# Altium schematic sheet WARNING_LEDS.SchDoc
size A; DocumentNumber: 8; SheetNumber: 8; SheetTotal: 12
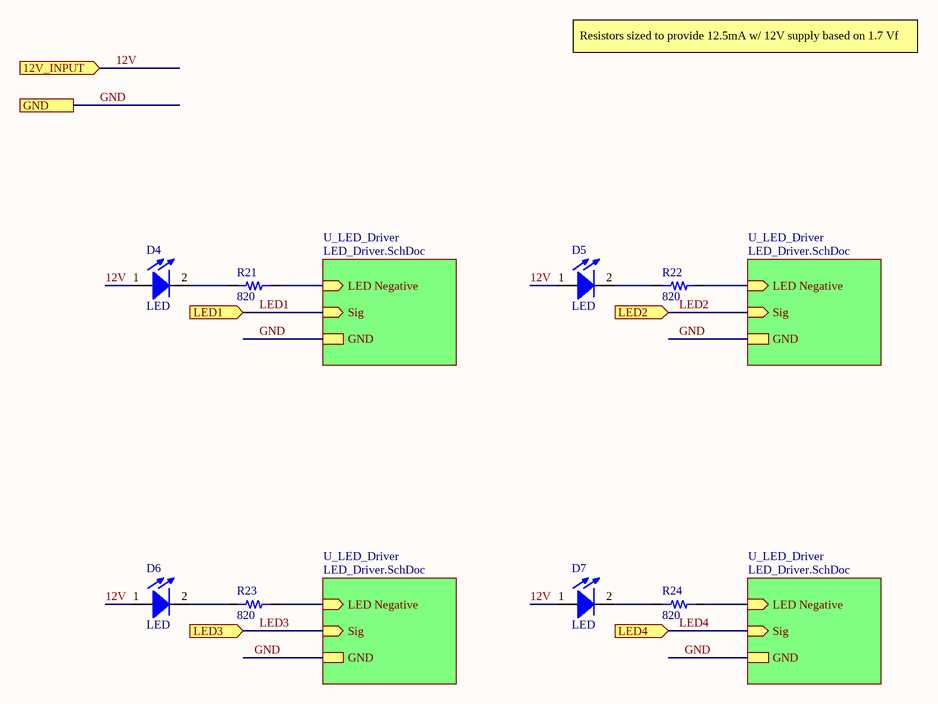
[diagram p0: WARNING_LEDS.SchDoc]

## Parts
D4  LED  [LED TH]
D5  LED  [LED TH]
D6  LED  [LED TH]
D7  LED  [LED TH]
R21  820  [RES 0805/2012]
R22  820  [RES 0805/2012]
R23  820  [RES 0805/2012]
R24  820  [RES 0805/2012]

## Sub-sheets
U_LED_Driver = LED_Driver.SchDoc: Sig (in), GND, LED Negative (in)
U_LED_Driver = LED_Driver.SchDoc: Sig (in), GND, LED Negative (in)
U_LED_Driver = LED_Driver.SchDoc: Sig (in), GND, LED Negative (in)
U_LED_Driver = LED_Driver.SchDoc: Sig (in), GND, LED Negative (in)

## Ports
12V_INPUT (in), GND, LED1 (in), LED2 (in), LED3 (in), LED4 (in)

## Nets
12V: D4.1(A) D5.1(A) D6.1(A) D7.1(A) ; port 12V_INPUT
GND: port GND, sheet U_LED_Driver/GND, sheet U_LED_Driver/GND, sheet U_LED_Driver/GND, sheet U_LED_Driver/GND
LED1: port LED1, sheet U_LED_Driver/Sig
LED2: port LED2, sheet U_LED_Driver/Sig
LED3: port LED3, sheet U_LED_Driver/Sig
LED4: port LED4, sheet U_LED_Driver/Sig
NetD4_2: D4.2(K) R21.1
NetD5_2: D5.2(K) R22.1
NetD6_2: D6.2(K) R23.1
NetD7_2: D7.2(K) R24.1
NetR21_2: R21.2 ; sheet U_LED_Driver/LED Negative
NetR22_2: R22.2 ; sheet U_LED_Driver/LED Negative
NetR23_2: R23.2 ; sheet U_LED_Driver/LED Negative
NetR24_2: R24.2 ; sheet U_LED_Driver/LED Negative

## Notes on the sheet
- Resistors sized to provide 12.5mA w/ 12V supply based on 1.7 Vf

## Library data of the parts
D4-D7 = 23: Thru Hole LED; id: 23; vr: 2.59999990463257; numcircuits: 1; updatedby: Andrew; name: LED; quantity: 1; createdby: Andrew; createddate: 10/16/2019 10:17:38 PM; updateddate: 10/16/2019 10:17:38 PM
R21-R24 = 2: id: 2; name: 0805 Resistor; percent tolerance: 5; power: 1/4; resistance: 820; package: 0805; quantity: 0; createdby: Kevin